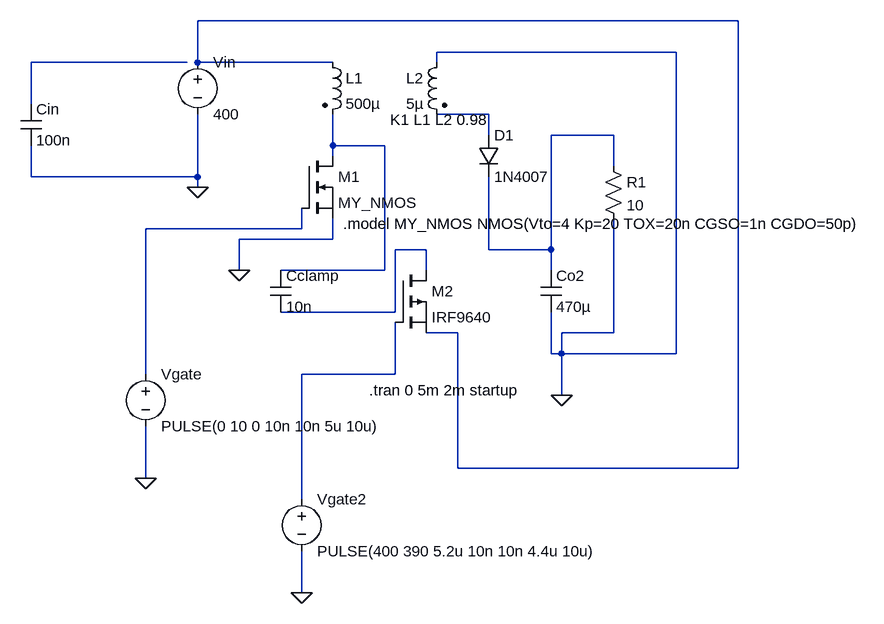
[diagram p0: schematic Draft2.asc]
Draft2.asc, the LTspice schematic file:
Version 4
SHEET 1 1332 1060
WIRE 768 160 -64 160
WIRE 672 208 304 208
WIRE -80 224 -320 224
WIRE -64 224 -64 160
WIRE 144 224 -64 224
WIRE 304 224 304 208
WIRE -320 288 -320 224
WIRE 384 304 304 304
WIRE 384 336 384 304
WIRE 576 336 480 336
WIRE 144 352 144 304
WIRE 224 352 144 352
WIRE 144 368 144 352
WIRE 576 384 576 336
WIRE -320 400 -320 352
WIRE -64 400 -64 304
WIRE -64 400 -320 400
WIRE -64 416 -64 400
WIRE 96 480 96 448
WIRE 96 480 -144 480
WIRE 144 496 144 464
WIRE 144 496 0 496
WIRE 288 512 240 512
WIRE 384 512 384 400
WIRE 480 512 480 336
WIRE 480 512 384 512
WIRE 0 544 0 496
WIRE 224 544 224 352
WIRE 224 544 64 544
WIRE 288 544 288 512
WIRE 480 544 480 512
WIRE 240 608 240 512
WIRE 240 608 64 608
WIRE 336 640 288 640
WIRE 576 640 576 464
WIRE 576 640 496 640
WIRE 480 672 480 608
WIRE 496 672 496 640
WIRE 496 672 480 672
WIRE 672 672 672 208
WIRE 672 672 496 672
WIRE -144 704 -144 480
WIRE 240 704 240 624
WIRE 240 704 96 704
WIRE 496 736 496 672
WIRE 336 848 336 640
WIRE 768 848 768 160
WIRE 768 848 336 848
WIRE -144 864 -144 784
WIRE 96 896 96 704
WIRE 96 1040 96 976
FLAG 496 736 0
FLAG 0 544 0
FLAG -144 864 0
FLAG -64 416 0
FLAG 96 1040 0
DATAFLAG 32 496 ""
SYMBOL voltage -64 208 R0
WINDOW 123 0 0 Left 0
WINDOW 39 0 0 Left 0
SYMATTR InstName Vin
SYMATTR Value 400
SYMBOL ind2 128 208 R0
SYMATTR InstName L1
SYMATTR Value 500µ
SYMATTR Type ind
SYMBOL ind2 320 208 M0
SYMATTR InstName L2
SYMATTR Value 5µ
SYMATTR Type ind
SYMBOL cap -336 288 R0
SYMATTR InstName Cin
SYMATTR Value 100n
SYMBOL cap 464 544 R0
SYMATTR InstName Co2
SYMATTR Value 470µ
SYMBOL cap 48 544 R0
SYMATTR InstName Cclamp
SYMATTR Value 10n
SYMBOL res 560 368 R0
SYMATTR InstName R1
SYMATTR Value 10
SYMBOL nmos 96 368 R0
SYMATTR InstName M1
SYMATTR Value MY_NMOS
SYMBOL pmos 240 544 R0
SYMATTR InstName M2
SYMATTR Value IRF9640
SYMBOL diode 368 336 R0
SYMATTR InstName D1
SYMATTR Value 1N4007
SYMBOL voltage -144 688 R0
WINDOW 123 0 0 Left 0
WINDOW 39 0 0 Left 0
SYMATTR InstName Vgate
SYMATTR Value PULSE(0 10 0 10n 10n 5u 10u)
SYMBOL voltage 96 880 R0
WINDOW 123 0 0 Left 0
WINDOW 39 0 0 Left 0
SYMATTR InstName Vgate2
SYMATTR Value PULSE(400 390 5.2u 10n 10n 4.4u 10u)
TEXT 232 312 Left 2 !K1 L1 L2 0.98
TEXT 200 728 Left 2 !.tran 0 5m 2m startup
TEXT 160 472 Left 2 !.model MY_NMOS NMOS(Vto=4 Kp=20 TOX=20n CGSO=1n CGDO=50p)

The netlist it stands for:
* Draft2.asc
Vin N001 0 400
L1 N001 N005 500µ
L2 0 N003 5µ
Cin N002 0 100n
Co2 N004 0 470µ
Cclamp N005 N007 10n
R1 N004 0 10
M1 N005 N006 0 0 MY_NMOS
M2 N007 N008 N001 N001 IRF9640
D1 N003 N004 1N4007
Vgate N006 0 PULSE(0 10 0 10n 10n 5u 10u)
Vgate2 N008 0 PULSE(400 390 5.2u 10n 10n 4.4u 10u)
.model D D
.lib standard.dio
.model NMOS NMOS
.model PMOS PMOS
.lib standard.mos
K1 L1 L2 0.98
.tran 0 5m 2m startup
.model MY_NMOS NMOS(Vto=4 Kp=20 TOX=20n CGSO=1n CGDO=50p)
.backanno
.end